# Altium schematic sheet P2.MCU.SchDoc
size A
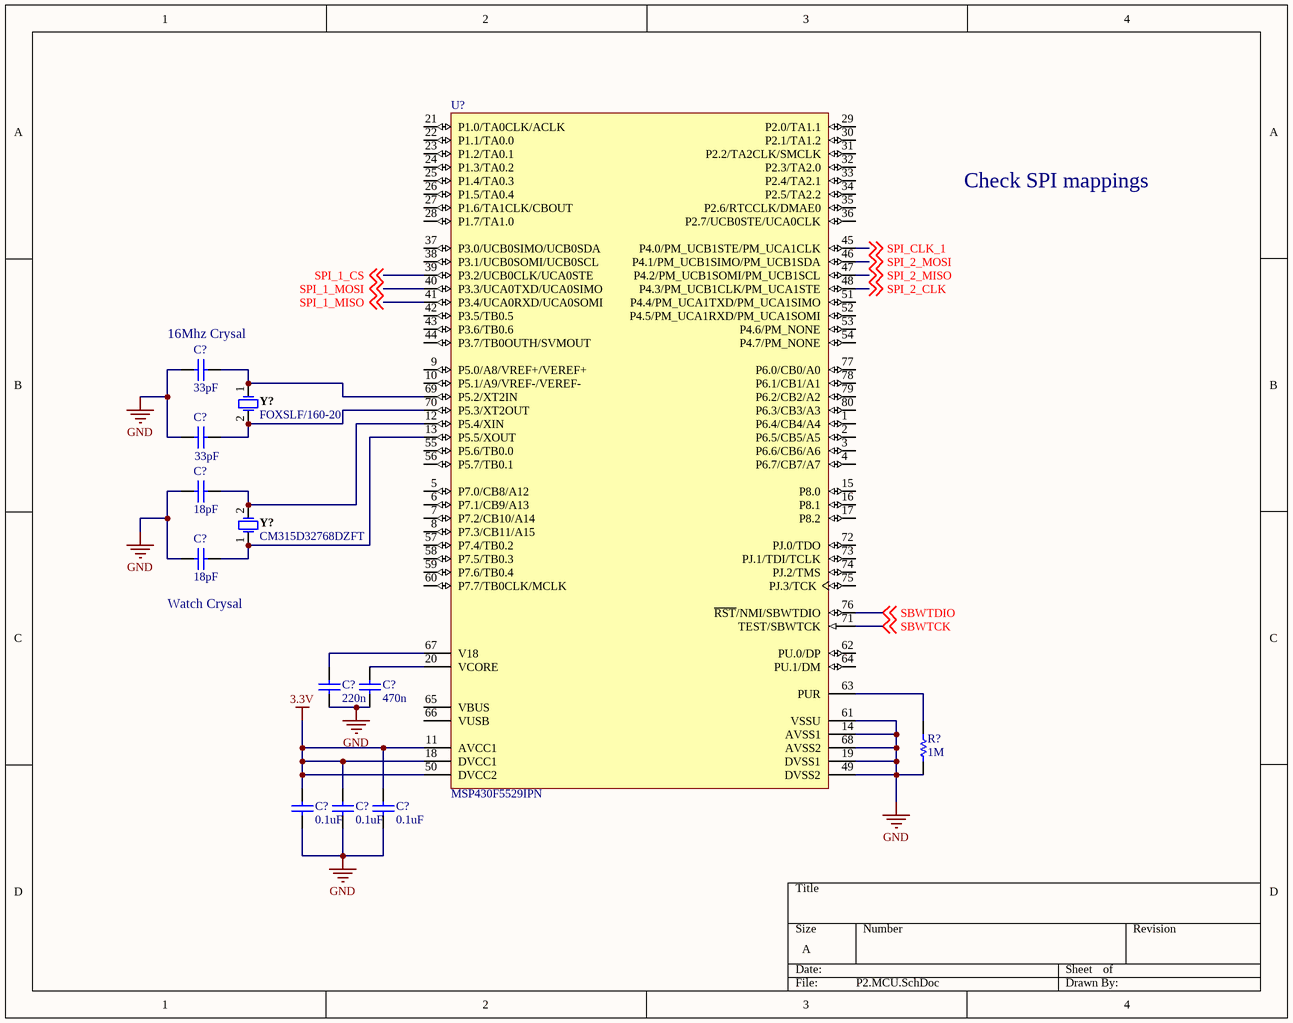
[diagram p0: P2.MCU.SchDoc]

## Parts
(Parts that share a designator on the sheet are numbered #1, #2 ... from top to bottom, then left to right.)
C?#1  33pF  [CAPC2013X88X50ML20T25]
C?#2  33pF  [CAPC2013X88X50ML20T25]
C?#3  18pF  [CAPC2013X71X50LL20T25]
C?#4  18pF  [CAPC2013X71X50LL20T25]
C?#5  220n  [CAPC1608X90X35ML10T15]
C?#6  470n  [CAPC2013X140X50ML20T25]
C?#7  0.1uF  [CAPC1608X05L]
C?#8  0.1uF  [CAPC1608X05L]
C?#9  0.1uF  [CAPC1608X05L]
R?  1M  [RESC2013X70X40NL20T20]
U?  MSP430F5529IPN  [PN0080A_L]
Y?#1  FOXSLF/160-20  [FOX-FOXSLF160-20]
Y?#2  CM315D32768DZFT  [CMHT-CM315D-2_V]

## Nets
3.3V: C?#7.2 C?#8.2 C?#9.2 U?.11(AVCC1) U?.18(DVCC1) U?.50(DVCC2)
GND: C?#1.1 C?#2.1 C?#3.1 C?#4.1 C?#5.1 C?#6.1 C?#7.1 C?#8.1 C?#9.1 R?.1 U?.14(AVSS1) U?.19(DVSS1) U?.49(DVSS2) U?.61(VSSU) U?.68(AVSS2)
SBWTCK: U?.71(TEST/SBWTCK) ; off-sheet SBWTCK
SBWTDIO: U?.76(~{RST}/NMI/SBWTDIO) ; off-sheet SBWTDIO
SPI_1_CS: U?.39(P3.2/UCB0CLK/UCA0STE) ; off-sheet SPI_1_CS
SPI_1_MISO: U?.41(P3.4/UCA0RXD/UCA0SOMI) ; off-sheet SPI_1_MISO
SPI_1_MOSI: U?.40(P3.3/UCA0TXD/UCA0SIMO) ; off-sheet SPI_1_MOSI
SPI_2_CLK: U?.48(P4.3/PM_UCB1CLK/PM_UCA1STE) ; off-sheet SPI_2_CLK
SPI_2_MISO: U?.47(P4.2/PM_UCB1SOMI/PM_UCB1SCL) ; off-sheet SPI_2_MISO
SPI_2_MOSI: U?.46(P4.1/PM_UCB1SIMO/PM_UCB1SDA) ; off-sheet SPI_2_MOSI
SPI_CLK_1: U?.45(P4.0/PM_UCB1STE/PM_UCA1CLK) ; off-sheet SPI_CLK_1
NetC?#1_2: C?#1.2 U?.69(P5.2/XT2IN) Y?#1.1
NetC?#2_2: C?#2.2 U?.70(P5.3/XT2OUT) Y?#1.2
NetC?#3_2: C?#3.2 U?.12(P5.4/XIN) Y?#2.2
NetC?#4_2: C?#4.2 U?.13(P5.5/XOUT) Y?#2.1
NetC?#5_2: C?#5.2 U?.67(V18)
NetC?#6_2: C?#6.2 U?.20(VCORE)
NetR?_2: R?.2 U?.63(PUR)

Not connected (* = marked no-connect by the designer): U? 1(P6.4/CB4/A4) 2(P6.5/CB5/A5) 3(P6.6/CB6/A6) 4(P6.7/CB7/A7) 5(P7.0/CB8/A12) 6(P7.1/CB9/A13) 7(P7.2/CB10/A14) 8(P7.3/CB11/A15) 9(P5.0/A8/VREF+/VEREF+) 10(P5.1/A9/VREF-/VEREF-) 15(P8.0) 16(P8.1) 17(P8.2) 21(P1.0/TA0CLK/ACLK) 22(P1.1/TA0.0) 23(P1.2/TA0.1) 24(P1.3/TA0.2) 25(P1.4/TA0.3) 26(P1.5/TA0.4) 27(P1.6/TA1CLK/CBOUT) 28(P1.7/TA1.0) 29(P2.0/TA1.1) 30(P2.1/TA1.2) 31(P2.2/TA2CLK/SMCLK) 32(P2.3/TA2.0) 33(P2.4/TA2.1) 34(P2.5/TA2.2) 35(P2.6/RTCCLK/DMAE0) 36(P2.7/UCB0STE/UCA0CLK) 37(P3.0/UCB0SIMO/UCB0SDA) 38(P3.1/UCB0SOMI/UCB0SCL) 42(P3.5/TB0.5) 43(P3.6/TB0.6) 44(P3.7/TB0OUTH/SVMOUT) 51(P4.4/PM_UCA1TXD/PM_UCA1SIMO) 52(P4.5/PM_UCA1RXD/PM_UCA1SOMI) 53(P4.6/PM_NONE) 54(P4.7/PM_NONE) 55(P5.6/TB0.0) 56(P5.7/TB0.1) 57(P7.4/TB0.2) 58(P7.5/TB0.3) 59(P7.6/TB0.4) 60(P7.7/TB0CLK/MCLK) 62(PU.0/DP) 64(PU.1/DM) 65(VBUS) 66(VUSB) 72(PJ.0/TDO) 73(PJ.1/TDI/TCLK) 74(PJ.2/TMS) 75(PJ.3/TCK) 77(P6.0/CB0/A0) 78(P6.1/CB1/A1) 79(P6.2/CB2/A2) 80(P6.3/CB3/A3)

## Notes on the sheet
- Check SPI mappings
- (near C?#1) 16Mhz Crysal
- (near C?#4) Watch Crysal

## Library data of the parts
C?#1 C?#2 = CMP-2007-00456-1: Part Number: C0805C330J1GACTU; Manufacturer: Kemet
C?#3 C?#4 = CMP-2007-04502-1: Manufacturer: AVX Interconnect / Elco; Part Number: 08055A180JAT2A
C?#5 = CMP-2006-02876-1: Manufacturer: Murata; Part Number: GRM188R71E224KA88D
C?#6 = CMP-2007-04691-1: Manufacturer: AVX Interconnect / Elco; Part Number: 08055C474KAT2A
C?#7-C?#9 = CC0603JRX7R9BB104: Cap Ceramic 0.1uF 50V X7R 5% SMD 0603 125C Paper T/R; Manufacturer: Yageo; Capacitance: 100nF; Supplier 1: Digi-Key; Manufacturer Part Number: CC0603JRX7R9BB104; Stock 1: 40000; Pricing 1: 1=0.17, 10=0.12, 100=0.0562, 500=0.03942, 1000=0.03263 (USD); Mount: Surface Mount; Case/Package: 0603; Number of Pins: 2; Weight: 7.1E-05oz; Case Code (Imperial): 0603; Case Code (Metric): 1608; Min Operating Temperature: -55°C; Max Operating Temperature: 125°C; Tolerance: 5%; Dielectric: X7R; Voltage Rating: 50V; Packaging: Tape and Reel; Voltage Rating (DC): 50V; Termination: SMD/SMT; Composition: Ceramic; Length: 1.6mm; Height: 0.8mm; Width: 0.031inch; Thickness: 0.035inch; Depth: 0.8mm; Radiation Hardening: No; Lead Free: Lead Free; Halogen Free: Halogen Free; ComponentLink1URL: http://www.yageo.com/documents/recent/UPY-GPHC_X7R_6.3V-to-50V_8.pdf; ComponentLink1Description: http://www.yageo.com/documents/recent/UPY-GPHC_X7R_6.3V-to-50V_8.pdf
R? = CMP-1665-00012-4: Chip Resistor, 1000 KOhm, +/- 1%, 0.125 W, -55 to 155 degC, 0805 (2012 Metric), RoHS, Tape and Reel; Manufacturer: Panasonic; Voltage Rating: 150 V; ComponentLink2URL: http://industrial.panasonic.com/cdbs/www-data/pdf/RDA0000/AOA0000C86.pdf; PackageReference: 0805; Min Operating Temperature: -55 degC; RoHSCompliant: true; Package Quantity: 5000; ComponentLink1URL: http://www.panasonic.com/; Pins: 2; Height: 0.6 mm; Packaging: Tape and Reel; ComponentLink2Description: Datasheet; ComponentLink1Description: Manufacturer URL; Mounting Technology: Surface Mount; REACH SVHC: Yes; Mount: Surface Mount; PackageDescription: 2-Pin Surface Mount Device, Body 2 x 1.25 mm; DatasheetVersion: 04/2015; Max Operating Temperature: 155 degC; Length: 2 mm
U? = CMP-0365-00412-2: 25 MHz Mixed Signal Microcontroller with 128 KB Flash, 8192 B SRAM and 63 GPIOs, -40 to 85 degC, 80-pin QFP (PN), Green (RoHS & no Sb/Br); Manufacturer: Texas Instruments; USCI_B (I2C & SPI): 2; Comparators: Yes; SubFamily: 5 Series; Flash(KB): 128; ADC: 12-bit SAR; DMA: 3; SRAM(B): 8192; ADC Channels: 16; GPIO: 63; Timers - 16-bit: 4; Multiplier: 32x32; USB: 1; Frequency(MHz): 25; PackageDescription: 80-Pin Plastic Quad Flat Pack, Body 12 x 12 mm, Pitch 0.5 mm; ComponentLink3Description: Package Specification; PackageReference: PN0080A; Brown Out Reset: Yes; Mounting Technology: Surface Mount; ComponentLink3URL: http://www.ti.com/lit/ml/mtqf010a/mtqf010a.pdf; ComponentLink2Description: Datasheet; Real-Time Clock: Yes; ComponentLink1Description: Manufacturer URL; PartNumber: MSP430F5529IPN; Temp Sensor: Yes; USCI_A (UART/LIN/IrDA/SPI): 2; Code_JEDEC: MS-018; Watchdog: Yes; Eco-Plan: Green (RoHS & no Sb/Br); ComponentLink2URL: http://www.ti.com/general/docs/lit/getliterature.tsp?genericPartNumber=MSP430F5529&fileType=pdf; SVS: Yes; ComponentLink1URL: http://www.ti.com/; DatasheetVersion: SLAS590I
Y?#1 = CMP-1749-00003-1: Resistance Weld Thru-Hole Crystal, 16 MHz, -20 to 70 degC, 2-Pin THD, RoHS, Bulk; Voltage Rating: 250 V; Tolerance: 1%; Resistance: 221 kohm; Case\Package: Axial; Power Rating: 250 mW; RoHSCompliant: true; Package Quantity: 200; Packaging: Bulk; Min Operating Temperature: -55 degC; DatasheetVersion: Mar-15; ComponentLink1URL: http://www.foxonline.com/; Max Operating Temperature: 155 degC; PackageReference: FOXSLF160-20; Mount: Through Hole; PackageDescription: 2-Pin Through Hole Device, Body 11.35 x 4.65 mm; ComponentLink1Description: Manufacturer URL; ComponentLink2URL: http://www.foxonline.com/pdfs/hc49slf.pdf; ComponentLink2Description: Datasheet; Length: 0.248 inch
Y?#2 = CMP-2000-05089-1: Turning Fork Crystal Unit, 32.768 KHz, -40 to 85 degC, 2-Pin SMD, RoHS, Tape and Reel; Manufacturer: Citizen Micro HumanTech; Package Version: Rev. 1.4, 09/2012; Package Reference: CM315D-2; Package Description: 2-Pin Surface Mount Device, Body 1.6 x 3.3 mm, Pitch 2.5 mm; Package URL: http://cfm.citizen.co.jp/english/product/pdf/CM315D.pdf; Manufacturer URL: http://www.citizen-systems.com/us/start; Datasheet Version: Rev. 1.4, 09/2012; Datasheet URL: http://cfm.citizen.co.jp/english/product/pdf/CM315D.pdf